# Altium schematic sheet TDA2004.SchDoc
size A4
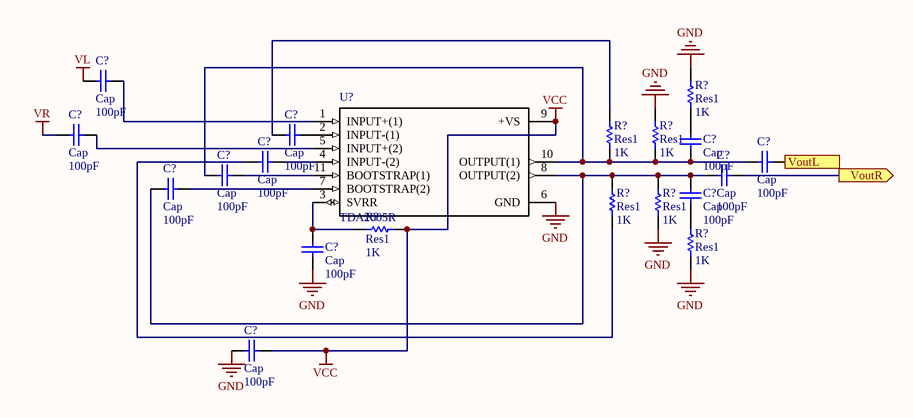
[diagram p0: TDA2004.SchDoc]

## Parts
(Parts that share a designator on the sheet are numbered #1, #2 ... from top to bottom, then left to right.)
C?#1  Cap  value 100pF  [RAD-0.3]
C?#2  Cap  value 100pF  [RAD-0.3]
C?#3  Cap  value 100pF  [RAD-0.3]
C?#4  Cap  value 100pF  [RAD-0.3]
C?#5  Cap  value 100pF  [RAD-0.3]
C?#6  Cap  value 100pF  [RAD-0.3]
C?#7  Cap  value 100pF  [RAD-0.3]
C?#8  Cap  value 100pF  [RAD-0.3]
C?#9  Cap  value 100pF  [RAD-0.3]
C?#10  Cap  value 100pF  [RAD-0.3]
C?#11  Cap  value 100pF  [RAD-0.3]
C?#12  Cap  value 100pF  [RAD-0.3]
R?#1  Res1  value 1K  [AXIAL-0.3]
R?#2  Res1  value 1K  [AXIAL-0.3]
R?#3  Res1  value 1K  [AXIAL-0.3]
R?#4  Res1  value 1K  [AXIAL-0.3]
R?#5  Res1  value 1K  [AXIAL-0.3]
R?#6  Res1  value 1K  [AXIAL-0.3]
R?#7  Res1  value 1K  [AXIAL-0.3]
U?  TDA2005R  [TO170P500X1990X2138-11P]

## Ports
VoutL (out), VoutR (out)

## Nets
GND: C?#11.1 C?#12.1 R?#1.2 R?#3.2 R?#6.1 R?#7.1 U?.6(GND)
VCC: C?#12.2 R?#4.2 U?.9(+VS)
VL: C?#1.1
VR: C?#2.1
VoutL: C?#6.2 ; port VoutL
VoutR: C?#8.2 ; port VoutR
NetC?#1_2: C?#1.2 U?.1(INPUT+(1))
NetC?#2_2: C?#2.2 U?.5(INPUT+(2))
NetC?#3_1: C?#3.1 R?#2.2
NetC?#3_2: C?#3.2 U?.2(INPUT-(1))
NetC?#4_1: C?#4.1 R?#5.1
NetC?#4_2: C?#4.2 U?.4(INPUT-(2))
NetC?#5_1: C?#5.1 C?#6.1 C?#7.1 R?#2.1 R?#3.1 U?.10(OUTPUT(1))
NetC?#5_2: C?#5.2 R?#1.1
NetC?#7_2: C?#7.2 U?.11(BOOTSTRAP(1))
NetC?#8_1: C?#8.1 C?#9.1 C?#10.2 R?#5.2 R?#6.2 U?.8(OUTPUT(2))
NetC?#9_2: C?#9.2 U?.7(BOOTSTRAP(2))
NetC?#10_1: C?#10.1 R?#7.2
NetC?#11_2: C?#11.2 R?#4.1 U?.3(SVRR)

## Library data of the parts
C?#1-C?#12 = Cap: Capacitor; Published: 8-Jun-2000; LatestRevisionDate: 17-Jul-2002; LatestRevisionNote: Re-released for DXP Platform.; PackageReference: RAD-0.3; Publisher: Altium Limited; PackageDescription: Radial Cap, Thru-Hole; 2 Leads; 0.3 in Pin Spacing
R?#1-R?#7 = Res1: Resistor; Published: 8-Jun-2000; LatestRevisionDate: 17-Jul-2002; LatestRevisionNote: Re-released for DXP Platform.; PackageReference: AXIAL-0.3; Publisher: Altium Limited; PackageDescription: Axial Device, Thru-Hole; 2 Leads; 0.3 in Pin Spacing
U? = TDA2005R: Audio Amp Speaker 1-CH Mono/2-CH Stereo 22W Class-B Automotive 11-Pin_11+Tab_ MULTIWATT Tube; MF: STMicroelectronics; MP: TDA2005R; SnapEDA_Link: https://www.snapeda.com/parts/TDA2005R/STMicroelectronics/view-part/?ref=snap; Package: Multiwatt-11 STMicroelectronics; Digi-Key_Part_Number: *; Digi-Key_Purchase_URL: *; Value: *